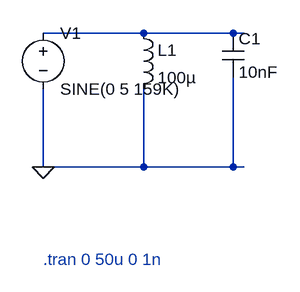
[diagram p0: schematic lc-tank.asc]
lc-tank.asc, the LTspice schematic file:
Version 4
SHEET 1 880 680
WIRE 192 96 480 96
WIRE 192 176 192 288
WIRE 336 176 336 288
WIRE 464 160 464 288
WIRE 192 288 480 288
SYMBOL voltage 192 80 R0
SYMATTR InstName V1
SYMATTR Value SINE(0 5 159K)
SYMBOL ind 320 80 R0
SYMATTR InstName L1
SYMATTR Value 100µ
SYMBOL cap 448 96 R0
SYMATTR InstName C1
SYMATTR Value 10nF
FLAG 192 288 0
TEXT 192 420 Left 2 .tran 0 50u 0 1n

The netlist it stands for:
* lc-tank.asc
V1 N001 0 SINE(0 5 159K)
L1 N001 0 100µ
C1 N001 0 10nF
* .tran 0 50u 0 1n
.backanno
.end